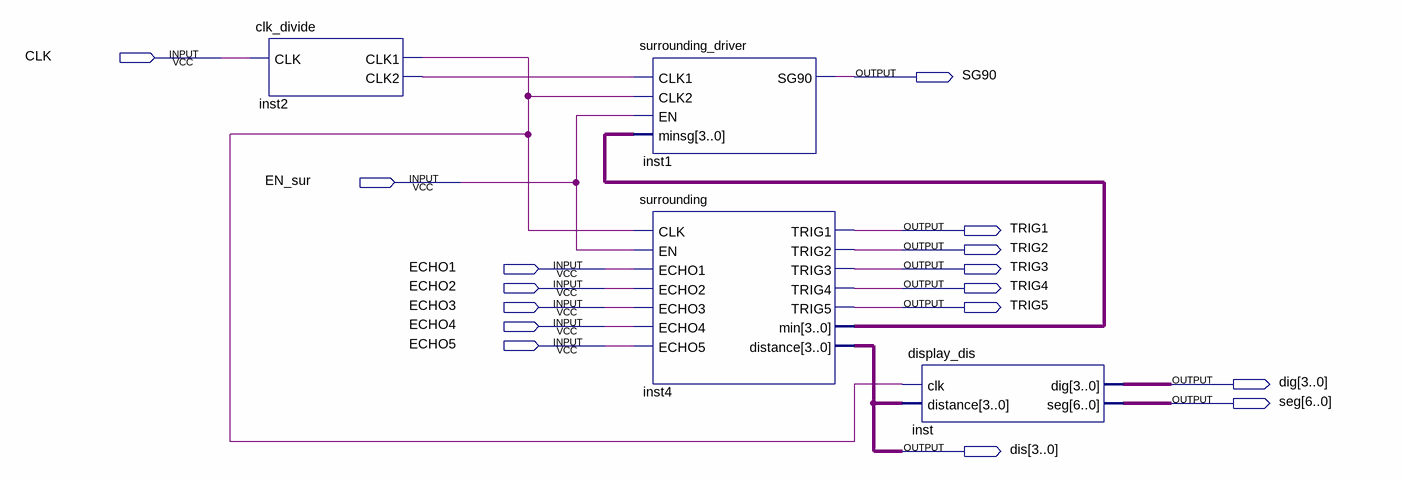
[diagram p0: schematic sheet]
// Quartus schematic sur.bdf as structural Verilog: 4 symbols, 16 pins
module sur (
  input  CLK,
  input  EN_sur,
  input  ECHO1,
  input  ECHO2,
  input  ECHO3,
  input  ECHO4,
  input  ECHO5,
  output SG90,
  output TRIG1,
  output TRIG2,
  output TRIG3,
  output TRIG4,
  output TRIG5,
  output [3:0] dig,
  output [6:0] seg,
  output [3:0] dis
);

  wire inst2_clk1, inst2_clk2;
  wire [3:0] inst4_min;

  clk_divide inst2 (.CLK(CLK), .CLK1(inst2_clk1), .CLK2(inst2_clk2));
  surrounding_driver inst1 (.CLK1(inst2_clk2), .CLK2(inst2_clk1), .EN(EN_sur), .minsg(inst4_min), .SG90(SG90));
  surrounding inst4 (
    .CLK(inst2_clk1), .EN(EN_sur), .ECHO1(ECHO1), .ECHO2(ECHO2), .ECHO3(ECHO3), .ECHO4(ECHO4), .ECHO5(ECHO5),
    .TRIG1(TRIG1), .TRIG2(TRIG2), .TRIG3(TRIG3), .TRIG4(TRIG4), .TRIG5(TRIG5), .min(inst4_min), .distance(dis));
  display_dis inst (.clk(inst2_clk1), .distance(dis), .dig(dig), .seg(seg));
endmodule
